# EAGLE schematic NinjaLAMP_Arduino_simple (EAGLE 9.6.1)
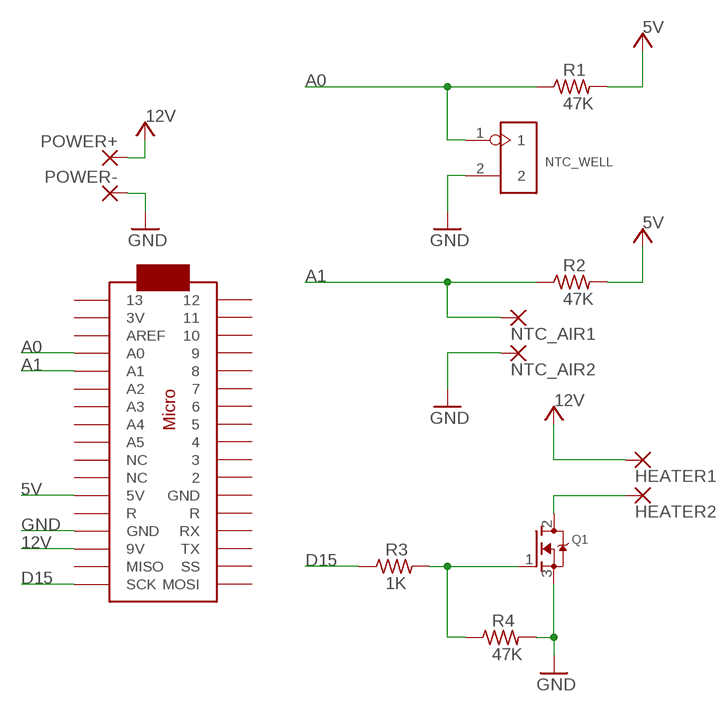
[diagram p0: schematic, sheet 1]

## Parts
HEATER1  1,6/0,8  [1,6/0,8]
HEATER2  1,6/0,8  [1,6/0,8]
NTC_AIR1  1,6/0,8  [1,6/0,8]
NTC_AIR2  1,6/0,8  [1,6/0,8]
NTC_WELL  2p-2.54  DIP-BLACK-MALE-HEADER-VERT(2P-2.54)  [H2-2.54]
POWER+  1,6/0,8  [1,6/0,8]
POWER-  1,6/0,8  [1,6/0,8]
Q1  MOSFET-NGDS_TO220V  [TO220V]
R1  47K  R-US_0207/10  [0207/10]
R2  47K  R-US_0207/10  [0207/10]
R3  1K  R-US_0207/10  [0207/10]
R4  47K  R-US_0207/10  [0207/10]
U$1  ARDUINOMICRO  [ARDUINOMICRO]

## Nets
5V: R1.2 R2.2 U$1.P$23(5V)
12V: HEATER1.1(P) POWER+.1(P) U$1.P$20(9V)
A0: NTC_WELL.1 R1.1 U$1.P$31(A0)
A1: NTC_AIR1.1(P) R2.1 U$1.P$30(A1)
D15: R3.1 U$1.P$18(SCK)
DRAIN: HEATER2.1(P) Q1.2(D)
GATE: Q1.1(G) R3.2 R4.1
GND: NTC_AIR2.1(P) NTC_WELL.2 POWER-.1(P) Q1.3(S) R4.2 U$1.P$12(GND)
Unconnected: U$1.P$1 U$1.P$2 U$1.P$3 U$1.P$4 U$1.P$5 U$1.P$6 U$1.P$7 U$1.P$8 U$1.P$9 U$1.P$10 U$1.P$11 U$1.P$13(R) U$1.P$14(RX) U$1.P$15(TX) U$1.P$16(SS) U$1.P$17(MOSI) U$1.P$19(MISO) U$1.P$21(GND) U$1.P$22(R) U$1.P$24(NC) U$1.P$25(NC) U$1.P$26(A5) U$1.P$27(A4) U$1.P$28(A3) U$1.P$29(A2) U$1.P$32(AREF) U$1.P$33(3V) U$1.P$34

## Library data of the parts
HEATER1 HEATER2 NTC_AIR1 NTC_AIR2 POWER+ POWER- = wirepad:1,6/0,8: THROUGH-HOLE PAD
NTC_WELL = OPL_Connector:DIP-BLACK-MALE-HEADER-VERT(2P-2.54): 320020016; MPN: P125-1102A0BS116A1
Q1 = adafruit:MOSFET-N: N-Channel Mosfet 2N7002E - 60V 260mA SOT23 [Digikey: 2N7002ET1GOSTR-ND] - REEL BSH103 - 30V 850mA SOT23 [Digikey: 568-5013-1-ND]
R1-R4 = resistor:R-US_: RESISTOR, American symbol
U$1 = adafruit:ARDUINOMICRO